# EAGLE schematic power (EAGLE 8.2.1)
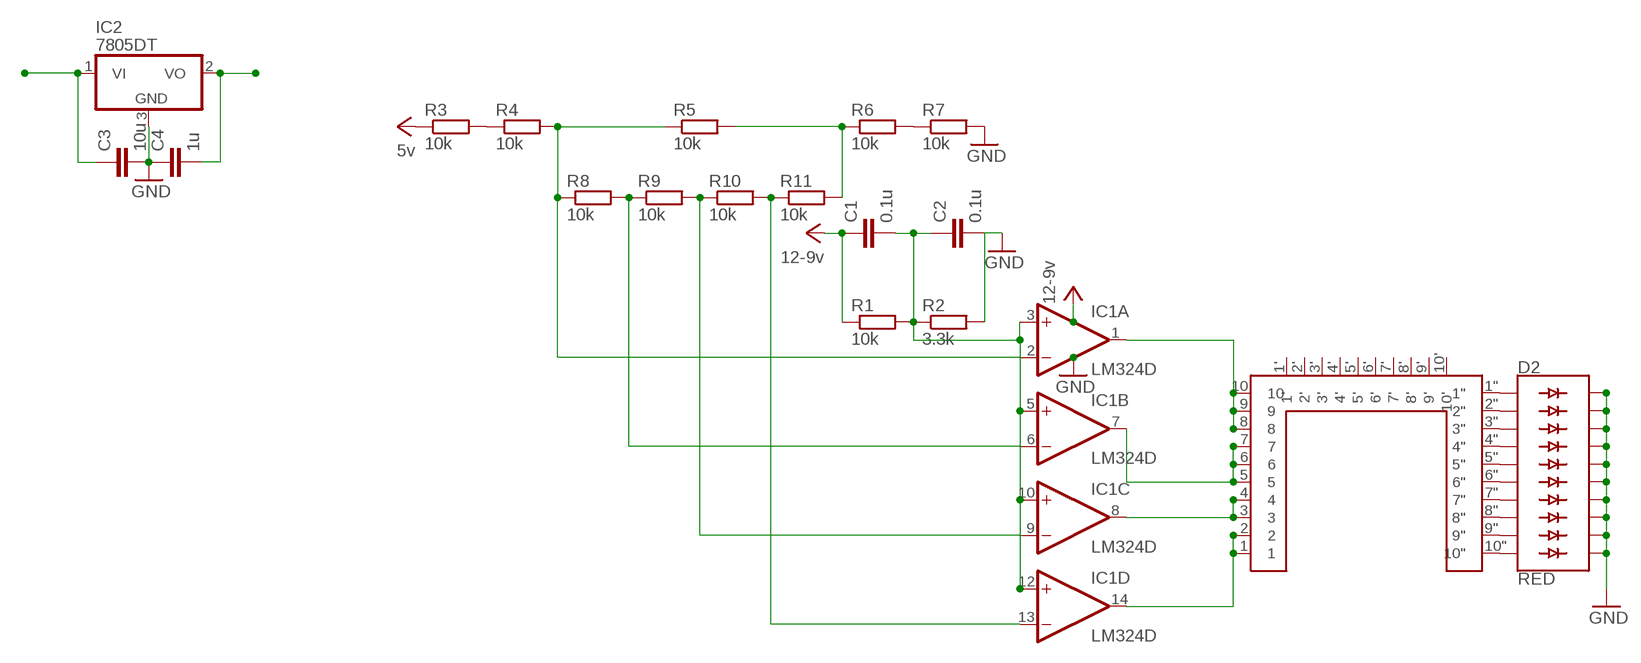
[diagram p0: schematic, sheet 1]

## Parts
C1  0.1u  C-EUC1206  [C1206]
C2  0.1u  C-EUC1206  [C1206]
C3  10u  C-EUC1206  [C1206]
C4  1u  C-EUC1206  [C1206]
D2  RED  LED_BARGRAPH_10RED  [LED_BARGRAPH_10]
IC1  LM324D  [SO14]
IC2  7805DT  [TO252]
R1  10k  R-EU_M1206  [M1206]
R2  3.3k  R-EU_M1206  [M1206]
R3  10k  R-EU_M1206  [M1206]
R4  10k  R-EU_M1206  [M1206]
R5  10k  R-EU_M1206  [M1206]
R6  10k  R-EU_M1206  [M1206]
R7  10k  R-EU_M1206  [M1206]
R8  10k  R-EU_M1206  [M1206]
R9  10k  R-EU_M1206  [M1206]
R10  10k  R-EU_M1206  [M1206]
R11  10k  R-EU_M1206  [M1206]
U$1  SWITCH  [SWITCH]

## Nets
GND: C2.2 C3.2 C4.1 D2.11(C9) D2.12(C8) D2.13(C7) D2.14(C6) D2.15(C5) D2.16(C4) D2.17(C3) D2.18(C2) D2.19(C1) D2.20(C) IC2.3(GND) R2.2 R7.2
N$1: R3.2 R4.1
N$2: C1.2 C2.1 IC1.3(A:+IN) IC1.5(B:+IN) IC1.10(C:+IN) IC1.12(D:+IN) R1.2 R2.1
N$3: IC1.2(A:-IN) R4.2 R5.1 R8.1
N$4: R5.2 R6.1 R11.2
N$5: R6.2 R7.1
N$6: IC1.6(B:-IN) R8.2 R9.1
N$7: IC1.9(C:-IN) R9.2 R10.1
N$8: IC1.13(D:-IN) R10.2 R11.1
N$9: IC1.1(A:OUT) U$1.8 U$1.9 U$1.10
N$10: IC1.7(B:OUT) U$1.5 U$1.6 U$1.7
N$11: IC1.8(C:OUT) U$1.3 U$1.4
N$12: IC1.14(D:OUT) U$1.1 U$1.2
N$13: D2.1(A) U$1.1"
N$14: D2.2(A1) U$1.2"
N$15: D2.3(A2) U$1.3"
N$16: D2.4(A3) U$1.4"
N$17: D2.5(A4) U$1.5"
N$18: D2.6(A5) U$1.6"
N$19: D2.7(A6) U$1.7"
N$20: D2.8(A7) U$1.8"
N$21: D2.9(A8) U$1.9"
N$22: D2.10(A9) U$1.10"
N$24: C3.1 IC2.1(VI)
N$25: C4.2 IC2.2(VO)
VCC: C1.1 R1.1 R3.1 ; supply symbol labelled 12-9v, 5v
Unconnected: U$1.1' U$1.2' U$1.3' U$1.4' U$1.5' U$1.6' U$1.7' U$1.8' U$1.9' U$1.10'

## Power pins joined to a net without a drawn wire
V+: IC1.4(P:V+)
V-: IC1.11(P:V-)

## Library data of the parts
C1-C4 = rcl:C-EU: CAPACITOR, European symbol
D2 = SparkFun-LED:LED_BARGRAPH_10: Young Sun LED Tech - YSLB-10251G5-10 10-Segment LED Bar Graph Features: Red Vf = 2.1V, Ifmax = 20mA Yellow Vf = 2.1V, Ifmax = 20mA Blue Vf = 3.4V, Ifmax = 20mA Green Vf = 3.4V, Ifmax = 20mA SparkFun Products: Red <https://www.sparkfun.com/products/9935> Yellow <https://www.sparkfun.com/products/9936> Green <https://www.sparkfun.com/products/9938> Blue <https://www.sparkfun.com/products/9937>; PROD_ID: DIO-10615
IC1 = linear:LM324: OP AMP
IC2 = linear:78*: Positive VOLTAGE REGULATOR Source: http://cache.national.com/ds/LM/LM78L05.pdf http://www.fairchildsemi.com/ds/LM/LM7805.pdf
R1-R11 = resistor:R-EU_: RESISTOR, European symbol
U$1 = switch:SWITCH